# Altium schematic sheet Adafruit CLUE nRF52840 Express.SchDoc: Adafruit CLUE nRF52840 Express
size 411 x 284 mm; Date: 2021/5/15 10:10:22; SheetNumber: 1; COMPANY: COMPANY; DRAWN: DRAWN; REV: REV; YEAR: YEAR; Origin: Eagle; GateName_1: G$1; SymbolName_1: FRAME_A3; LibraryName: microbuilder; DeviceSetName: FRAME_A3; GateName_2: G$3; SymbolName_2: FRAME_DOCFIELD; DRG: DRG; o: o; N: N; C: C; ISSUE: ISSUE; FILE: FILE:; PAGE: PAGE:; CHECKED: CHECKED; DRGNO: >DRGNO
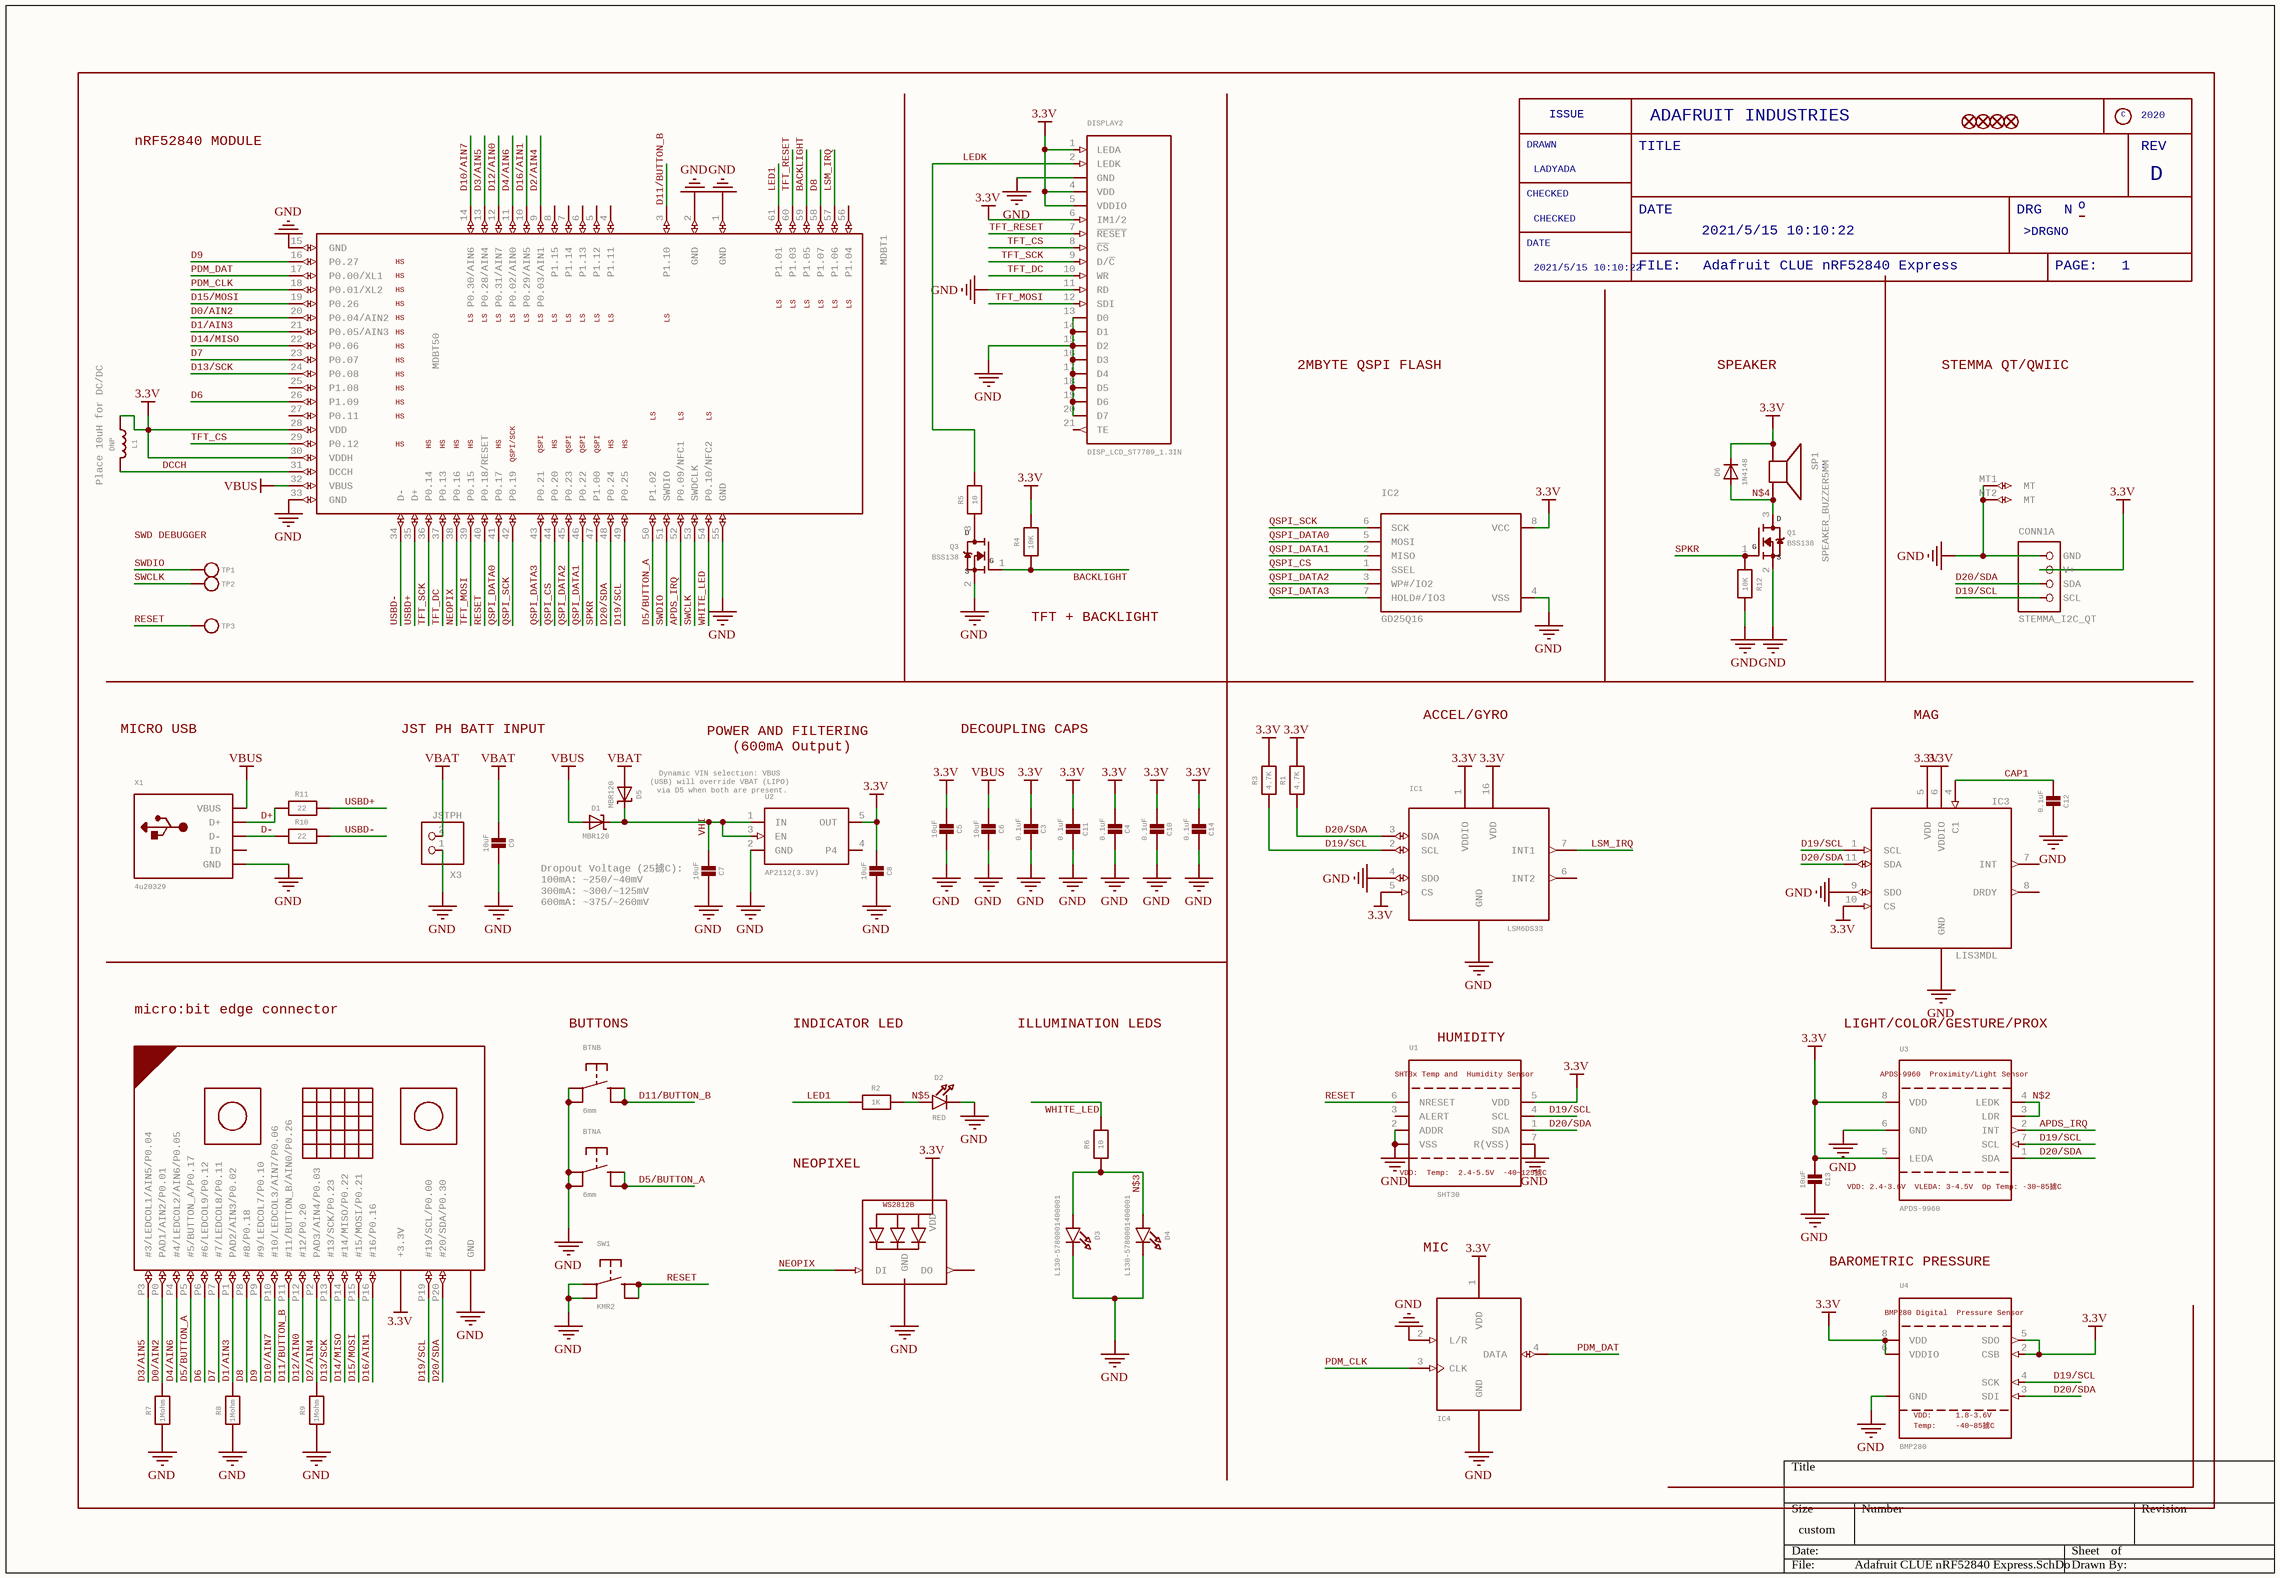
[diagram p0: Adafruit CLUE nRF52840 Express.SchDoc]

## Parts
BTNA  6mm  [6MMX6MM_TACTILE_SMT]
BTNB  6mm  [6MMX6MM_TACTILE_SMT]
C3  0.1uF  [0603-NO]
C4  0.1uF  [0603-NO]
C5  10uF  [0805-NO]
C6  10uF  [0805-NO]
C7  10uF  [0805-NO]
C8  10uF  [0805-NO]
C9  10uF  [0805-NO]
C10  0.1uF  [0603-NO]
C11  0.1uF  [0603-NO]
C12  0.1uF  [0603-NO]
C13  10uF  [0805-NO]
C14  0.1uF  [0603-NO]
CONN1  STEMMA_I2C_QT  [JST_SH4]  (parts A,B,C of 3)
D1  MBR120  [SOD-123]
D2  RED  [CHIPLED_0603_NOOUTLINE]
D3  L130-5780001400001  [EVERLIGHT_45-21]
D4  L130-5780001400001  [EVERLIGHT_45-21]
D5  MBR120  [SOD-123]
D6  1N4148  [SOD-323]
DISPLAY2  DISP_LCD_ST7789_1.3IN  [TFT_1.3IN_240X240_24P]
FID1  FIDUCIAL_1MM  [FIDUCIAL_1MM]  (value not drawn)
FID2  FIDUCIAL_1MM  [FIDUCIAL_1MM]  (value not drawn)
FID3  FIDUCIAL_1MM  [FIDUCIAL_1MM]  (value not drawn)
FID4  FIDUCIAL_1MM  [FIDUCIAL_1MM]  (value not drawn)
IC1  LSM6DS33  [LGA16_3X3MM]
IC2  GD25Q16  [SOIC8_150MIL]
IC3  LIS3MDL  [LGA12_2X2MM]
IC4  MIC_PDM  [SPK0415HM4H]  (value not drawn)
L1  DNP  [_0805MP]
LED1  WS2812B3535  [LED3535]  (value not drawn)
MB1  MICRO:BIT_EDGE  [MICROBIT_EDGE]  (value not drawn)
MDBT1  MDBT50  [MDBT50]
Q1  BSS138  [SOT23-WIDE]
Q3  BSS138  [SOT23-WIDE]
R1  4.7K  [0603-NO]
R2  1K  [0603-NO]
R3  4.7K  [0603-NO]
R4  10K  [0603-NO]
R5  10  [0603-NO]
R6  10  [0603-NO]
R7  1Mohm  [0603-NO]
R8  1Mohm  [0603-NO]
R9  1Mohm  [0603-NO]
R10  22  [0603-NO]
R11  22  [0603-NO]
R12  10K  [0603-NO]
SP1  SPEAKER_BUZZER5MM  [BUZZER_SMT_5MM]
SW1  KMR2  [EVQ-Q2_SMALLER]
TP1  TESTPOINTROUND1.5MM  [TESTPOINT_ROUND_1.5MM]  (value not drawn)
TP2  TESTPOINTROUND1.5MM  [TESTPOINT_ROUND_1.5MM]  (value not drawn)
TP3  TESTPOINTROUND1.5MM  [TESTPOINT_ROUND_1.5MM]  (value not drawn)
U1  SHT30  SHT3xTempand
HumiditySensor: SHT3x Temp and / Humidity Sensor  VDD:
Temp: VDD: / Temp:  2.4-5.5V
-40~125掳C: 2.4-5.5V / -40~125掳C  [SHT3X]
U2  AP2112(3.3V)  [SOT23-5]
U3  APDS-9960  APDS-9960
Proximity/LightSensor: APDS-9960 / Proximity/Light Sensor  VDD:2.4-3.6V
VLEDA:3-4.5V
OpTemp:-30~85掳C: VDD: 2.4-3.6V / VLEDA: 3-4.5V / Op Temp: -30~85掳C  [APDS-9960]
U4  BMP280  BMP280Digital
PressureSensor: BMP280 Digital / Pressure Sensor  VDD: VDD:  Temp: Temp:  [BMP280]
X1  4u20329  [4UCONN_20329_SLIM]
X3  JSTPH  [JSTPH2]

## Nets
3.3V: C3.2 C4.2 C5.2 C8.2 C10.2 C11.2 C13.2 C14.2 CONN1.2(V+) D6.C DISPLAY2.1(LEDA) DISPLAY2.4(VDD) DISPLAY2.5(VDDIO) DISPLAY2.6(IM1/2) IC1.1(VDDIO) IC1.5(CS) IC1.16(VDD) IC2.8(VCC) IC3.5(VDD) IC3.6(VDDIO) IC3.10(CS) IC4.1(VDD) L1.1 LED1.2(VDD) MB1.+3V3_+3V3@1_+3V3@2(+3.3V) MDBT1.28(VDD) MDBT1.30(VDDH) R1.2 R3.2 R4.2 SP1.+ U1.5(VDD) U2.5(OUT) U3.5(LEDA) U3.8(VDD) U4.2(CSB) U4.5(SDO) U4.6(VDDIO) U4.8(VDD)
GND: BTNA.A(P) BTNA.A'(P1) BTNB.A(P) BTNB.A'(P1) C3.1 C4.1 C5.1 C6.1 C7.1 C8.1 C9.1 C10.1 C11.1 C12.1 C13.1 C14.1 CONN1.1(GND) CONN1.MT1(MT) CONN1.MT2(MT) D2.C D3.K(C) D4.K(C) DISPLAY2.3_23_24(GND) DISPLAY2.11(RD) DISPLAY2.13(D0) DISPLAY2.14(D1) DISPLAY2.15(D2) DISPLAY2.16(D3) DISPLAY2.17(D4) DISPLAY2.18(D5) DISPLAY2.19(D6) DISPLAY2.20(D7) IC1.4(SDO) IC1.8_9_10_11_12_13_15(GND) IC2.4(VSS) IC3.2_3_12(GND) IC3.9(SDO) IC4.2(L/R) IC4.5_6_7_8(GND) LED1.4(GND) MB1.GND_GND@1_GND@2(GND) MDBT1.1(GND) MDBT1.2(GND) MDBT1.15(GND) MDBT1.33(GND) MDBT1.55(GND) Q1.2(S) Q3.2(S) R7.1 R8.1 R9.1 R12.2 SW1.A(P) SW1.A'(P1) U1.2(ADDR) U1.7(R(VSS)) U1.8_THERMAL(VSS) U2.2(GND) U3.6(GND) U4.1_7(GND) X1.BASE@1_BASE@2_GND_SPRT@1_SPRT@2_SPRT@3_SPRT@4(GND) X3.1
VBAT: C9.2 D5.A X3.2
VBUS: C6.2 D1.A MDBT1.32(VBUS) X1.VBUS
APDS_IRQ: MDBT1.52(P0.09/NFC1) U3.2(INT)
BACKLIGHT: MDBT1.59(P1.05) Q3.1(G) R4.1
CAP1: C12.2 IC3.4(C1)
D0/AIN2: MB1.P0(PAD1/AIN2/P0.01) MDBT1.20(P0.04/AIN2) R7.2
D1/AIN3: MB1.P1(PAD2/AIN3/P0.02) MDBT1.21(P0.05/AIN3) R8.2
D2/AIN4: MB1.P2(PAD3/AIN4/P0.03) MDBT1.9(P0.03/AIN1) R9.2
D3/AIN5: MB1.P3(#3/LEDCOL1/AIN5/P0.04) MDBT1.13(P0.28/AIN4)
D4/AIN6: MB1.P4(#4/LEDCOL2/AIN6/P0.05) MDBT1.11(P0.02/AIN0)
D5/BUTTON_A: BTNA.B(S) BTNA.B'(S1) MB1.P5(#5/BUTTON_A/P0.17) MDBT1.50(P1.02)
D6: MB1.P6(#6/LEDCOL9/P0.12) MDBT1.26(P1.09)
D7: MB1.P7(#7/LEDCOL8/P0.11) MDBT1.23(P0.07)
D8: MB1.P8(#8/P0.18) MDBT1.58(P1.07)
D9: MB1.P9(#9/LEDCOL7/P0.10) MDBT1.16(P0.27)
D10/AIN7: MB1.P10(#10/LEDCOL3/AIN7/P0.06) MDBT1.14(P0.30/AIN6)
D11/BUTTON_B: BTNB.B(S) BTNB.B'(S1) MB1.P11(#11/BUTTON_B/AIN0/P0.26) MDBT1.3(P1.10)
D12/AIN0: MB1.P12(#12/P0.20) MDBT1.12(P0.31/AIN7)
D13/SCK: MB1.P13(#13/SCK/P0.23) MDBT1.24(P0.08)
D14/MISO: MB1.P14(#14/MISO/P0.22) MDBT1.22(P0.06)
D15/MOSI: MB1.P15(#15/MOSI/P0.21) MDBT1.19(P0.26)
D16/AIN1: MB1.P16(#16/P0.16) MDBT1.10(P0.29/AIN5)
D19/SCL: CONN1.4(SCL) IC1.2(SCL) IC3.1(SCL) MB1.P19(#19/SCL/P0.00) MDBT1.49(P0.25) R3.1 U1.4(SCL) U3.7(SCL) U4.4(SCK)
D20/SDA: CONN1.3(SDA) IC1.3(SDA) IC3.11(SDA) MB1.P20(#20/SDA/P0.30) MDBT1.48(P0.24) R1.1 U1.1(SDA) U3.1(SDA) U4.3(SDI)
D+: R11.1 X1.D+
D-: R10.1 X1.D-
DCCH: L1.2 MDBT1.31(DCCH)
LED1: MDBT1.61(P1.01) R2.1
LEDK: DISPLAY2.2(LEDK) R5.2
LSM_IRQ: IC1.7(INT1) MDBT1.57(P1.06)
N$2: U3.3(LDR) U3.4(LEDK)
N$3: D3.A D4.A R6.1
N$4: D6.A Q1.3(D) SP1.-
N$5: D2.A R2.2
NEOPIX: LED1.1(DI) MDBT1.38(P0.16)
PDM_CLK: IC4.3(CLK) MDBT1.18(P0.01/XL2)
PDM_DAT: IC4.4(DATA) MDBT1.17(P0.00/XL1)
QSPI_CS: IC2.1(SSEL) MDBT1.44(P0.20)
QSPI_DATA0: IC2.5(MOSI) MDBT1.41(P0.17)
QSPI_DATA1: IC2.2(MISO) MDBT1.46(P0.22)
QSPI_DATA2: IC2.3(WP#/IO2) MDBT1.45(P0.23)
QSPI_DATA3: IC2.7(HOLD#/IO3) MDBT1.43(P0.21)
QSPI_SCK: IC2.6(SCK) MDBT1.42(P0.19)
RESET: MDBT1.40(P0.18/RESET) SW1.B(S) SW1.B'(S1) TP3.P$1 U1.6(NRESET)
SPKR: MDBT1.47(P1.00) Q1.1(G) R12.1
SWCLK: MDBT1.53(SWDCLK) TP2.P$1
SWDIO: MDBT1.51(SWDIO) TP1.P$1
TFT_CS: DISPLAY2.8(~{CS}) MDBT1.29(P0.12)
TFT_DC: DISPLAY2.10(WR) MDBT1.37(P0.13)
TFT_MOSI: DISPLAY2.12(SDI) MDBT1.39(P0.15)
TFT_RESET: DISPLAY2.7(~{RESET}) MDBT1.60(P1.03)
TFT_SCK: DISPLAY2.9(D/~{C}) MDBT1.36(P0.14)
USBD+: MDBT1.35(D+) R11.2
USBD-: MDBT1.34(D-) R10.2
VHI: C7.2 D1.C D5.C U2.1(IN) U2.3(EN)
WHITE_LED: MDBT1.54(P0.10/NFC2) R6.2
NetQ3_3: Q3.3(D) R5.1

Not connected (* = marked no-connect by the designer): DISPLAY2 21(TE); IC1 6(INT2); IC3 7(INT) 8(DRDY); LED1 3(DO); MDBT1 4(P1.11) 5(P1.12) 6(P1.13) 7(P1.14) 8(P1.15) 25(P1.08) 27(P0.11) 56(P1.04); U1 3(ALERT); U2 4(P4); X1 ID

## Notes on the sheet
- ISSUE
- ADAFRUIT INDUSTRIES
- C
- 2020
- nRF52840 MODULE
- DRAWN
- CHECKED
- LADYADA
- TITLE
- REV
- D
- DATE
- 2021/5/15 10:10:22
- FILE:
- Adafruit CLUE nRF52840 Express
- DRG
- >DRGNO
- PAGE:
- N
- o
- 1
- 2MBYTE QSPI FLASH
- SPEAKER
- STEMMA QT/QWIIC
- (near L1) Place 10uH for DC/DC
- SWD DEBUGGER
- TFT + BACKLIGHT
- MICRO USB
- JST PH BATT INPUT
- POWER AND FILTERING
  (600mA Output)
- DECOUPLING CAPS
- ACCEL/GYRO
- MAG
- (near D5) Dynamic VIN selection: VBUS
  (USB) will override VBAT (LIPO)
  via D5 when both are present.
- (near C7) Dropout Voltage (25掳C):
  100mA: ~250/~40mV
  300mA: ~300/~125mV
  600mA: ~375/~260mV
- micro:bit edge connector
- BUTTONS
- INDICATOR LED
- ILLUMINATION LEDS
- HUMIDITY
- LIGHT/COLOR/GESTURE/PROX
- (near LED1) NEOPIXEL
- (near IC4) MIC
- BAROMETRIC PRESSURE

## Library data of the parts
BTNA BTNB = SWITCH_TACT_SMT_6MM: SMT Tact Switches 6x6mm - Digikey: P12940SCT-ND  KMR2 (4.6x2.8mm) - Digikey: 401-1426-1-ND  EVQ-PQHB55 - Light Touch, 160GF (4.5x4.5mm) - Digikey: P8090SCT-ND  KMT0 - KMT021 NGJ LHS (etc.) IP68/Waterproof - Digikey: CKN10289CT-ND; GateName_1: G$1; SymbolName_1: BUTTON_4PIN; DeviceName: _6MM; LibraryName: microbuilder; DeviceSetName: SWITCH_TACT_SMT
C3 C4 C10-C12 C14 = CAP_CERAMIC0603_NO: Ceramic Capacitors   For new designs, use the packages preceded by an '_' character since they are more reliable:   The following footprints should be used on most boards: _0402 - Standard footprint for regular board layouts  _0603 - Standard footprint for regular board layouts  _0805 - Standard footprint for regular board layouts  _1206 - Standard footprint for regular board layouts       For extremely tight-pitch boards where space is at a premium, the following 'micro-pitch' footprints can be used (smaller pads, no silkscreen outline, etc.): _0402MP - Micro-pitch footprint for very dense/compact boards  _0603MP - Micro-pitch footprint for very dense/compact boards  _0805MP - Micro-pitch footprint for very dense/compact boards  _1206MP - Micro-pitch footprint for very dense/compact boards; GateName_1: G$1; SymbolName_1: CAPACITOR; DeviceName: 0603_NO; LibraryName: microbuilder; DeviceSetName: CAP_CERAMIC
C5-C9 C13 = CAP_CERAMIC0805-NOOUTLINE: Ceramic Capacitors   For new designs, use the packages preceded by an '_' character since they are more reliable:   The following footprints should be used on most boards: _0402 - Standard footprint for regular board layouts  _0603 - Standard footprint for regular board layouts  _0805 - Standard footprint for regular board layouts  _1206 - Standard footprint for regular board layouts       For extremely tight-pitch boards where space is at a premium, the following 'micro-pitch' footprints can be used (smaller pads, no silkscreen outline, etc.): _0402MP - Micro-pitch footprint for very dense/compact boards  _0603MP - Micro-pitch footprint for very dense/compact boards  _0805MP - Micro-pitch footprint for very dense/compact boards  _1206MP - Micro-pitch footprint for very dense/compact boards; GateName_1: G$1; SymbolName_1: CAPACITOR; DeviceName: 0805-NOOUTLINE; LibraryName: microbuilder; DeviceSetName: CAP_CERAMIC
CONN1 = STEMMA_I2C_QT: GateName_1: G$1; GateName_2: G$2; SymbolName_2: MOUNTING; GateName_3: G$3; DeviceName: _QT; SymbolName_1: STEMMA_I2C; SymbolName_3: MOUNTING; LibraryName: microbuilder; DeviceSetName: STEMMA_I2C
D1 D5 = DIODE-SCHOTTKYSOD-123: GateName_1: G$1; SymbolName_1: DIODE-SCHOTTKY; DeviceName: SOD-123; LibraryName: microbuilder; DeviceSetName: DIODE-SCHOTTKY
D2 = LED0603_NOOUTLINE: LED0603 - 0603 Surface Mount Package    2mA: Green LED - Low Power (3.9mcd, 2ma, 1.7Vf) - Digikey: 475-2709-2-ND  Orange LED - Low Power (9.8mcd, 2ma, 1.8Vf) - Digikey: 475-1194-2-ND  Red LED - Low Power (5mcd, 2ma, 1.8Vf) - Digikey: 475-1195-2-ND  Yellow LED - Low Power (7mcd, 2ma, 1.8Vf) - Digikey: 475-1196-2-ND       5mA: Blue LED - Low Power (17mcd, 5ma, 2.9Vf) - Digikey: LNJ937W8CRACT-ND    0805 - 0805 Surface Mount Package    2mA: Red LED (8.8mcd, 2mA, 1.8Vf, Clear) - Low Power [Digikey: 475-2510-1-ND]  Green LED (5mcd, 2mA, 1.8Vf, Clear) - Low Power [Digikey: 475-2730-1-ND]  Yellow LED (11.3mcd, 2mA, 1.8Vf, Clear) - Low Power [Digikey: 475-2555-1-ND]       20mA: Red LED (104mcd, 20mA, Diffused) - LS R976 [Digikey: 475-1278-6-ND]  Red LED (12mcd, 20mA, 2.0Vf, Clear) - APT2012EC [Digikey: 754-1128-1-ND]  Green LED (15mcd, 20mA, 2.2Vf, Clear) - APT2012GC [Digikey: 754-1131-1-ND]  Orange LED (160mcd, 20mA, 2.1Vf, Clear) - APT2012SECK [Digikey: 754-1130-1-ND]     1206 - 1206 Surface Mount Package  Green LED (26mcd, 20mA, Diffused) - LG N971  [Digikey: 475-1407-6-ND]  Red LED (15mcd, 20mA, Diffused) - LH N974 [Digikey: 475-1416-6-ND]     Cree - Cree High-Power Surface Mount LEDs  XPEBWT-L1-0000-00D50 - White 111lm 350mA 2.9Vf 6200K 110掳  XTEAWT-00-0000-00000LEE3 - White 114lm 350mA 2.85Vf 5000K 115掳     Everlight - Everlight 45-21 Series Surface Mount LEDs  45-21/QK2C-B2832AC2CB2/2T - Warm White 2000mcd 20mA 3.25Vf 3050K 120掳  45-21/LK2C-B38452C4CB2/2T - Nuetral White 2000mcd 20mA 3.25Vf 4150K 120掳  45-21/LK2C-B50634C6CB2/2T - Cold White 2200mcd 20mA 3.25Vf 5650K 120掳     PLCC2 Reverse Mount LS T77K-J1L2-1-0-2-R18-Z - Red 11.25mcd 2mA 1.8Vf 630nm 120掳  LO T77K-L1M2-24-Z - Orange 19.6mcd 2mA 1.8Vf 606nm 120掳  LY T77K-K2M1-26-Z - Yellow 15.7mcd 2mA 1.8Vf 587nm 120掳; GateName_1: G$1; SymbolName_1: LED; DeviceName: 0603_NOOUTLINE; LibraryName: microbuilder; DeviceSetName: LED
D3 D4 = LEDEV45-21: LED0603 - 0603 Surface Mount Package    2mA: Green LED - Low Power (3.9mcd, 2ma, 1.7Vf) - Digikey: 475-2709-2-ND  Orange LED - Low Power (9.8mcd, 2ma, 1.8Vf) - Digikey: 475-1194-2-ND  Red LED - Low Power (5mcd, 2ma, 1.8Vf) - Digikey: 475-1195-2-ND  Yellow LED - Low Power (7mcd, 2ma, 1.8Vf) - Digikey: 475-1196-2-ND       5mA: Blue LED - Low Power (17mcd, 5ma, 2.9Vf) - Digikey: LNJ937W8CRACT-ND    0805 - 0805 Surface Mount Package    2mA: Red LED (8.8mcd, 2mA, 1.8Vf, Clear) - Low Power [Digikey: 475-2510-1-ND]  Green LED (5mcd, 2mA, 1.8Vf, Clear) - Low Power [Digikey: 475-2730-1-ND]  Yellow LED (11.3mcd, 2mA, 1.8Vf, Clear) - Low Power [Digikey: 475-2555-1-ND]       20mA: Red LED (104mcd, 20mA, Diffused) - LS R976 [Digikey: 475-1278-6-ND]  Red LED (12mcd, 20mA, 2.0Vf, Clear) - APT2012EC [Digikey: 754-1128-1-ND]  Green LED (15mcd, 20mA, 2.2Vf, Clear) - APT2012GC [Digikey: 754-1131-1-ND]  Orange LED (160mcd, 20mA, 2.1Vf, Clear) - APT2012SECK [Digikey: 754-1130-1-ND]     1206 - 1206 Surface Mount Package  Green LED (26mcd, 20mA, Diffused) - LG N971  [Digikey: 475-1407-6-ND]  Red LED (15mcd, 20mA, Diffused) - LH N974 [Digikey: 475-1416-6-ND]     Cree - Cree High-Power Surface Mount LEDs  XPEBWT-L1-0000-00D50 - White 111lm 350mA 2.9Vf 6200K 110掳  XTEAWT-00-0000-00000LEE3 - White 114lm 350mA 2.85Vf 5000K 115掳     Everlight - Everlight 45-21 Series Surface Mount LEDs  45-21/QK2C-B2832AC2CB2/2T - Warm White 2000mcd 20mA 3.25Vf 3050K 120掳  45-21/LK2C-B38452C4CB2/2T - Nuetral White 2000mcd 20mA 3.25Vf 4150K 120掳  45-21/LK2C-B50634C6CB2/2T - Cold White 2200mcd 20mA 3.25Vf 5650K 120掳     PLCC2 Reverse Mount LS T77K-J1L2-1-0-2-R18-Z - Red 11.25mcd 2mA 1.8Vf 630nm 120掳  LO T77K-L1M2-24-Z - Orange 19.6mcd 2mA 1.8Vf 606nm 120掳  LY T77K-K2M1-26-Z - Yellow 15.7mcd 2mA 1.8Vf 587nm 120掳; GateName_1: G$1; SymbolName_1: LED; DeviceName: EV45-21; LibraryName: microbuilder; DeviceSetName: LED
D6 = DIODESOD-323: Diode    SMA      Model	  Volts	  Amps	  Type	  Vf	  Ir	  Digikey #	  Notes	     SSA34-E3	  40V	  3A	  Schottky	  480mV @ 3A	  200uA @ 40V	  SSA34-E3/61TGITR-ND	  	     CDBA120-G	  20V	  1A	  Schottky	  500mV @ 1A	  500uA @ 20V	  641-1014-6-ND	  REEL	     MBRA210	  10V	  2A	  Schottky	  350mV @ 2A	  700uA @ 10V	  MBRA210LT3	  	 SOD-123      Model	  Volts	  Amps	  Type	  Vf	  Ir	  Order #	  Notes	     BAT54T1G	  30V	  200mA	  Schottky	  800mV @ 200mA	  2uA @ 25V	  BAT54T1GOSTR-ND	  	     B0530W	  30V	  500mA	  Schottky	  430mV @ 500mA	  130uA @ 30V	  B0530W-FDICT-ND	  REEL	     MBR120	  20V	  1A	  Schottky	  340mV @ 1A	  	  MBR120VLSFT1GOSCT-ND	  	 SOD-323      Model	  Volts	  Amps	  Type	  Vf	  Ir	  Order #	  Notes	     PMEG2005EJ	  20V	  500mA	  Schottky	  355mV @ 500mA	  	  568-4110-1-ND	  	     ZLLS410	  10V	  570mA	  Schottky	  380mV @ 570mA	  	  ZLLS410CT-ND	  	     1N4148WS	  75V	  150mA	  Silicon/Simple	  1V	  	  1N4148WSFSCT-ND	  REEL	 SOD-523      Model	  Volts	  Amps	  Type	  Vf	  Ir	  Order #	  Notes	     BAT54XV2	  30V	  200mA	  Schottky	  0.8V @ 100mA	  	  BAT54XV2CT-ND	  	     TB751S	  30V	  30mA	  Schottky	  	  	  RB751S-40TE61CT-ND	  	 SOT23-R/W (R = Solder Paste/Reflow Ovens, W = Hand-Soldering)       Model	  Volts	  Amps	  Type	  Vf	  Ir	  Order #	  Notes	     BAT54FILM	  40V	  300mA	  Schottky	  	  	  497-7162-1-ND	  	 POWERDI-5       Model	  Volts	  Amps	  Type	  Vf	  Ir	  Order #	  Notes	     PDS560	  60V	  5A	  Schottky	  670mV @ 5A	  150uA @ 60V	  PDS560DICT-ND; GateName_1: G$1; SymbolName_1: DIODE; DeviceName: SOD-323; LibraryName: microbuilder; DeviceSetName: DIODE
DISPLAY2 = DISP_LCD_ST7789_1.3IN: GateName_1: G$1; SymbolName_1: TFT_1.3IN_240X240; LibraryName: adafruit_display; DeviceSetName: DISP_LCD_ST7789_1.3IN
FID1-FID4 = FIDUCIAL_1MM: Fiducial Alignment Points   Various fiducial points for machine vision alignment.; GateName_1: G$1; DeviceName: _1MM; BOM: EXCLUDE; SymbolName_1: FIDUCIAL; LibraryName: microbuilder; DeviceSetName: FIDUCIAL
IC1 = LSM6DS33: GateName_1: G$1; SymbolName_1: LSM6DS33; LibraryName: adafruit_sensor; DeviceSetName: LSM6DS33; LSM6DS33: LSM6DS33
IC2 = SPIFLASH_8PIN: SOIC8 SPI Flash   Be careful with the size since SOIC8 flash comes in several 'widths'   SOIC8 150 mil M25P16 - 16Mbit (2Mbit x 8) Serial Flash (75MHz SPI Bus), Supply: 2.7-3.6V  Digikey:  SOIC8 - M25P16-VMN6P-ND       SOIC8 208 mil W25Q16BVSSIG - 16Mbit (2Mbit x 8) Serial Flash (104MHz SPI Bus), Supply: 2.7-3.6V  Digikey:  SOIC8 - W25Q16BVSSIG-ND; GateName_1: G$1; SymbolName_1: M25P16; LibraryName: microbuilder; DeviceSetName: SPIFLASH_8PIN
IC3 = LIS3MDL: Digital output magnetic sensor. ultra-low-power, high-performance 3-axis magnetometer; GateName_1: G$1; SymbolName_1: LIS3MDL; LibraryName: adafruit_sensor; DeviceSetName: LIS3MDL; LIS3MDL: LIS3MDL
IC4 = MIC_PDM_SPK0415: GateName_1: G$1; SymbolName_1: MIC_PDM; DeviceName: _SPK0415; LibraryName: microbuilder; DeviceSetName: MIC_PDM
L1 = INDUCTOR_0805MP: Inductors   0603: 10nH Ceramic Inductor - microwire antenna/RF (Digikey: 712-1434-2-ND)       0805: 560nH Ceramic Inductor - RF (Digikey: 553-1047-1-ND)  270nH Ceramic Inductor - Q = 40@250MHz, +-5%, 1 Ohm DC Resistance (Digikey: 535-10506-2-ND)       1007 (2518 Metric) SMT: 10碌H 10% 250mOhm 820mA 1007 Inductor (Digikey: 587-2189-1-ND)  22碌H 10% 500mOhm 580mA 1007 Inductor (Digikey: 587-2190-1-ND)  47碌H 10% 950mOhm 420mA 1007 Inductor (Digikey: 587-2191-1-ND)  47碌H 5% 100mOhm 1A 1008 Inductor (Digikey: 732-1816-1-ND)       5.0x5.0mm (Taiyo Yuden NR5040 Series) 6.8碌H 20% 2.3A 64mOhm Inductor (Digikey: 587-2374-2-ND)       5.0x5.0mm (TDK VLC5045 Series) 4.7碌H 20% 3.3A 34mOhm Inductor (Digikey: 445-6526-1-ND)  6.8碌H 20% 2.7A 46mOhm Inductor (Digikey: 445-6527-1-ND)       6.0x6.0mm (TDK VLC6045 Series) 4.7碌H 20% 3.8A 27mOhm Inductor (Digikey: 445-6538-2-ND)  6.8碌H 20% 3A 41mOhm Inductor (Digikey: 445-6540-1-ND)  6.2碌H 30% 2.2A 45mOhm Inductor (Digikey: SRR5028-6R2YCT-ND) - Not TDK VLC6045 but footprint should match       6.0x6.0mm (TDK SLF6045 Series) 6.8uH 30% 2A 33mOhm Inductor (Digikey: 445-4572-1-ND, Mouser: 810-SLF645T6R8N2R0PF)       6.0x6.0mm (Sumida CDRH5D28 Series) 6.2uH 30% 1.8A 45mOhm Inductor (Digikey: 308-1542-1-ND)       Taiyo Yuden NR3015T2R2M - 2.2uH 20% 1.5A (Digikey: 587-1648-2-ND, Mouser: 963-NR3015T2R2M) - Used with TI TPS62172   CoilCraft RFID Transponder Coil - MA5532-AE (For use with AS3935 Lightning Sensor)   Taiyo Yuden NRH2412T2R2MNGH - 2.2uH 20% 1AA (Digikey: 587-3443-1-ND) - Used with TI LM3671   Vishay IHLP  1.0uH Molded Inductor - 24mOhm DCR, 5A, +/-20%, -55掳C-125掳C (Digikey: 541-1319-1-ND); GateName_1: G$1; SymbolName_1: INDUCTOR; DeviceName: _0805MP; LibraryName: microbuilder; DeviceSetName: INDUCTOR
LED1 = WS2812B3535: GateName_1: G$1; SymbolName_1: WS2812BLED; DeviceName: 3535; LibraryName: microbuilder; DeviceSetName: WS2812B; WS2812B: WS2812B
MB1 = MICRO:BIT_EDGE: GateName_1: G$1; DeviceName: _EDGE; SymbolName_1: MICRO:BIT; LibraryName: adafruit_connector; DeviceSetName: MICRO:BIT
MDBT1 = MDBT50: Raytac Corporation   MDBT50  Bluetooth Low Energy Module based on Noridc nRF52840    Source:  Raytac datasheet; GateName_1: G$1; SymbolName_1: MDBT50; LibraryName: microbuilder; DeviceSetName: MDBT50; LS: LS; HS: HS; QSPI: QSPI; QSPI/SCK: QSPI/SCK
Q1 Q3 = MOSFET-NWIDE: N-Channel Mosfet   LEGEND   VDS: Voltage Drain-Source ID: Drain Current RDS(ON): Drain-Source On-State Resistance VGS(TH): Gate-Source Threshold Voltage CISS: Drain-Source Input Capacitance    SOT-23   Name	VDS	ID	RDS(ON)	VGS(TH)	CISS	Order Number	   2N7002E	60V	260mA	2.5 Ohm	2.5V @ 250uA	26.7pF @ 25V	2N7002ET1GOSTR-ND	   BSH103	30V	850mA	400 mOhm	400mV @ 1mA	83pF @ 24V	BSH103,235-ND	   BSS138	60V	320mA	1.6 Ohm	1.5V @ 250uA	50pF @ 10V	Mouser: 771-BSS138PW115	   DMN2075U-7	20V	4.2A	38 mOhm	1V @ 250 uA	594.3pF @ 10V	DMN2075U-7DICT-ND	   							   * BSS138 good choice for I2C level-shifting   POWERPAK 1212-8   Name	VDS	ID	RDS(ON)	VGS(TH)	CISS	Order Number	   Si7308DN	60V	6A	58 mOhm	3V @ 250uA	665pF @ 15V	SI7308DN-T1-E3CT-ND; GateName_1: G$1; DeviceName: WIDE; SymbolName_1: MOSFET-N; LibraryName: microbuilder; DeviceSetName: MOSFET-N; D: D; S: S; G: G
R1-R12 = RESISTOR_0603_NOOUT: Resistors   For new designs, use the packages preceded by an '_' character since they are more reliable:   The following footprints should be used on most boards: _0402 - Standard footprint for regular board layouts  _0603 - Standard footprint for regular board layouts  _0805 - Standard footprint for regular board layouts  _1206 - Standard footprint for regular board layouts       For extremely tight-pitch boards where space is at a premium, the following 'micro-pitch' footprints can be used (smaller pads, no silkscreen outline, etc.): _0402MP - Micro-pitch footprint for very dense/compact boards  _0603MP - Micro-pitch footprint for very dense/compact boards  _0805MP - Micro-pitch footprint for very dense/compact boards  _1206MP - Micro-pitch footprint for very dense/compact boards; GateName_1: G$1; SymbolName_1: RESISTOR; DeviceName: _0603_NOOUT; LibraryName: microbuilder; DeviceSetName: RESISTOR
SP1 = SPEAKER_BUZZER5MM: SPEAKER    Source: Buerklin   Added PS12 (for part # PS1240 piezo)    http://www.ladyada.net/library/pcb/eaglelibrary.html; GateName_1: S1; SymbolName_1: SP; DeviceName: _BUZZER5MM; LibraryName: microbuilder; DeviceSetName: SPEAKER
SW1 = SWITCH_TACT_SMT_EVQQ2_SMALL: SMT Tact Switches 6x6mm - Digikey: P12940SCT-ND  KMR2 (4.6x2.8mm) - Digikey: 401-1426-1-ND  EVQ-PQHB55 - Light Touch, 160GF (4.5x4.5mm) - Digikey: P8090SCT-ND  KMT0 - KMT021 NGJ LHS (etc.) IP68/Waterproof - Digikey: CKN10289CT-ND; GateName_1: G$1; SymbolName_1: BUTTON_4PIN; DeviceName: _EVQQ2_SMALL; LibraryName: microbuilder; DeviceSetName: SWITCH_TACT_SMT
TP1-TP3 = TESTPOINTROUND1.5MM: Test Point   Various test points for characterisation and PCB testing    TESTPOINT_SMT - Compact Surface Mount Test Point [Digikey: 5016KTR-ND]; GateName_1: G$1; SymbolName_1: TESTPOINT; DeviceName: ROUND1.5MM; LibraryName: microbuilder; DeviceSetName: TESTPOINT
U1 = SHT3X: SHT3x - Digital Temperature and Humidity Sensor    Supply Voltage: 2.4-5.5V  Humidity Accuracy: SHT30 = +/-3%RH, SHT31 = +/-2%RH  Temperature Sensor: -40~125掳C (+/-0.3掳C from 10-55C); GateName_1: G$1; SymbolName_1: SHT3X; LibraryName: microbuilder; DeviceSetName: SHT3X
U2 = VREG_SOT23-5: SOT23-5 Fixed Voltage Regulators      Part	Current Out	V Out	V In	V Dropout	胃JA (掳C/W)	TJ (掳C)	Digikey Part No.	     ADP121	  150mA	  3.3V	  3.4-5.5V	  0.09V @ 150mA	  --	  --	  ADP121-AUJZ33R7CT-ND	     ADP121	  150mA	  3.0V	  3.1-5.5V	  0.09V @ 150mA	  --	  --	  ADP121-AUJZ30R7CT-ND	     ADP122	  300mA	  3.3V	  3.4-5.5V	  0.085V @ 300mA	  --	  --	  ADP122AUJZ-3.3-R7CT-ND	     ADP1712	  300mA	  3.3V	  3.5-5.5V	  0.17V @ 300mA	  --	  --	  ADP1712AUJZ-3.3-R7TR-ND	     AP7311 (Low Cost)	  150mA	  3.3V	  3.5-6V	  0.15V @ 150mA	  --	  --	  AP7311-33WG-7DICT-ND	     LD39015M18R	  150mA	  1.8V	  1.9V-5.5V	  0.08V @ 100mA	  --	  --	  497-6977-1-ND	     LP2985A-33DBVR	  150mA	  3.3V	  3.3-16V	  0.28V @ 150mA	  206	  150	  296-18479-1-ND	     MCP1824T-3302E/OT	  300mA	  3.3V	  3.5V-6V	  0.2V @ 300mA	  --	  --	  MCP1824T-3302E/OTCT-ND	     MIC5205-2.5YM5 TR	  150mA	  2.5V	  2.7-16V	  0.165V @ 150mA	  --	  --	  576-1257-2-ND	     MIC5205-3.0YM5 TR	  150mA	  3.0V	  3.2V-16V	  0.165V @ 150mA	  --	  --	  576-1258-2-ND	     MIC5205-3.3YM5 TR	  150mA	  3.3V	  3.5V-16V	  0.165V @ 150mA	  --	  --	  576-1259-2-ND	     TPS780330220	  150mA	  3.3V+2.2V	  3.6-5.5V	  250mV Max	  --	  --	  296-23332-1-ND	     TDA3663/N1,135	  100mA	  3.3V	  3.5-45V	  0.18V @ 50mA	  --	  --	  568-5343-1-ND	     	  	  	  	  	  	  	  	     	  	  	  	  	  	  	  	   Max operating temp can be calculated using 胃JA, TJ (max junction temperature), and power in watts.  Set the "Maximum Ambient Temperature" until it reaches TJ ("Max Junction Temperature"), which is the absolute limit for safe use of the regulator: Heat Sink Temperature Calculator   For example, With 12V source into a 3.3V LP2985 and a 30mA load, we are dissipating (12V-3.3V) * 0.03A = 0.261W.  With a 胃JA of 206 掳C/W, a TJ of 150掳C, and 261mW we can safely use the chip without a heat sink up to 75掳C (=147.1掳C Junction Temperature).; GateName_1: G$1; SymbolName_1: VREG_SOT23-5; LibraryName: microbuilder; DeviceSetName: VREG_SOT23-5
U3 = APDS-9960: APDS-9960 - Digital Proximity Sensor with Ambient Light/RGB/Gesture Detection; GateName_1: G$1; SymbolName_1: APDS-9960; LibraryName: adafruit_sensor; DeviceSetName: APDS-9960
U4 = BMP280: BMP280 - Digital Pressure Sensor    Operating Pressure Range: 300-1100 hPa  Pressure Resolution: 0.16Pa  RMS Noise: 1.3Pa  Temperature Resolution: 0.01 C; GateName_1: G$1; SymbolName_1: BMP280; LibraryName: adafruit_sensor; DeviceSetName: BMP280; 1.8-3.6V: 1.8-3.6V; -40~85掳C: -40~85掳C
X1 = USB_SLIM: USB ConnectorsUSBMINIB - Surface Mount Female Mini-B USB Connector    4UConnector: 06564; GateName_1: G$1; DeviceName: _SLIM; SymbolName_1: USB; LibraryName: microbuilder; DeviceSetName: USB
X3 = CON_JST_PH_2PIN: JST 2-Pin Right-Angle Connector  PH-Series - 4UConnector: 17311  SH-Series - 4UConnector: 07278; GateName_1: G$1; SymbolName_1: PINHD2; LibraryName: microbuilder; DeviceSetName: CON_JST_PH_2PIN